# Altium schematic sheet Sch_Dr_NPX .SchDoc
size A4 portrait; Author: Noname; Address3: ULY; Revision: Ver.1.0
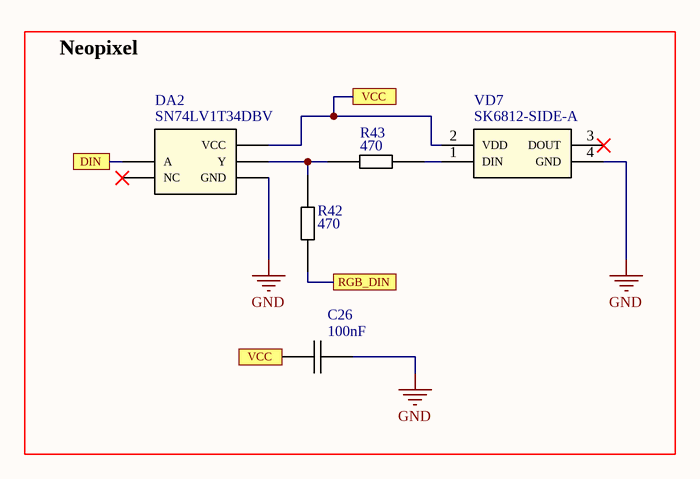
[diagram p0: Sch_Dr_NPX .SchDoc]

## Parts
C26  100nF  [Cap_0603]
DA2  SN74LV1T34DBV  [SOT-23-5]
R42  470  [Res_0603]
R43  470  [Res_0603]
VD7  SK6812-SIDE-A  [SK6812 (LED)]

## Blocks framed on the sheet
Neopixel: C26 DA2 R42 R43 VD7

## Ports
DIN, RGB_DIN, VCC

## Nets
GND: C26.2 DA2.3(GND) VD7.4(GND)
DIN: DA2.2(A) ; port DIN
RGB_DIN: R42.1 ; port RGB_DIN
VCC: C26.1 DA2.5(VCC) VD7.2(VDD) ; port VCC
NetDA2_4: DA2.4(Y) R42.2 R43.1
NetR43_2: R43.2 VD7.1(DIN)

Not connected (* = marked no-connect by the designer): DA2 1(NC)*; VD7 3(DOUT)*

## Notes on the sheet
- Title
- Size:
- Date:
- A4
- Number:
- Time:
- Revision:
- Sheet
- of
- File:

## Library data of the parts
C26 = Cap_: CC0603JRX7R8BB104
DA2 = SN74LV1T34DBV: Single Power Supply Single Buffer GATE CMOS Logic Level Sgifter
R42 R43 = Res_: CR-03FL7--470R
VD7 = SK6812-SIDE-A: LED chip